# EasyEDA schematic SCH_Mesa_Drivers_2022-08-13.json
TITLE: Sheet_1; REV: 1.0; Date: 2022-06-11; Sheet: 1/1; Drawn By: Edward Niedziejko; Company: Your Company
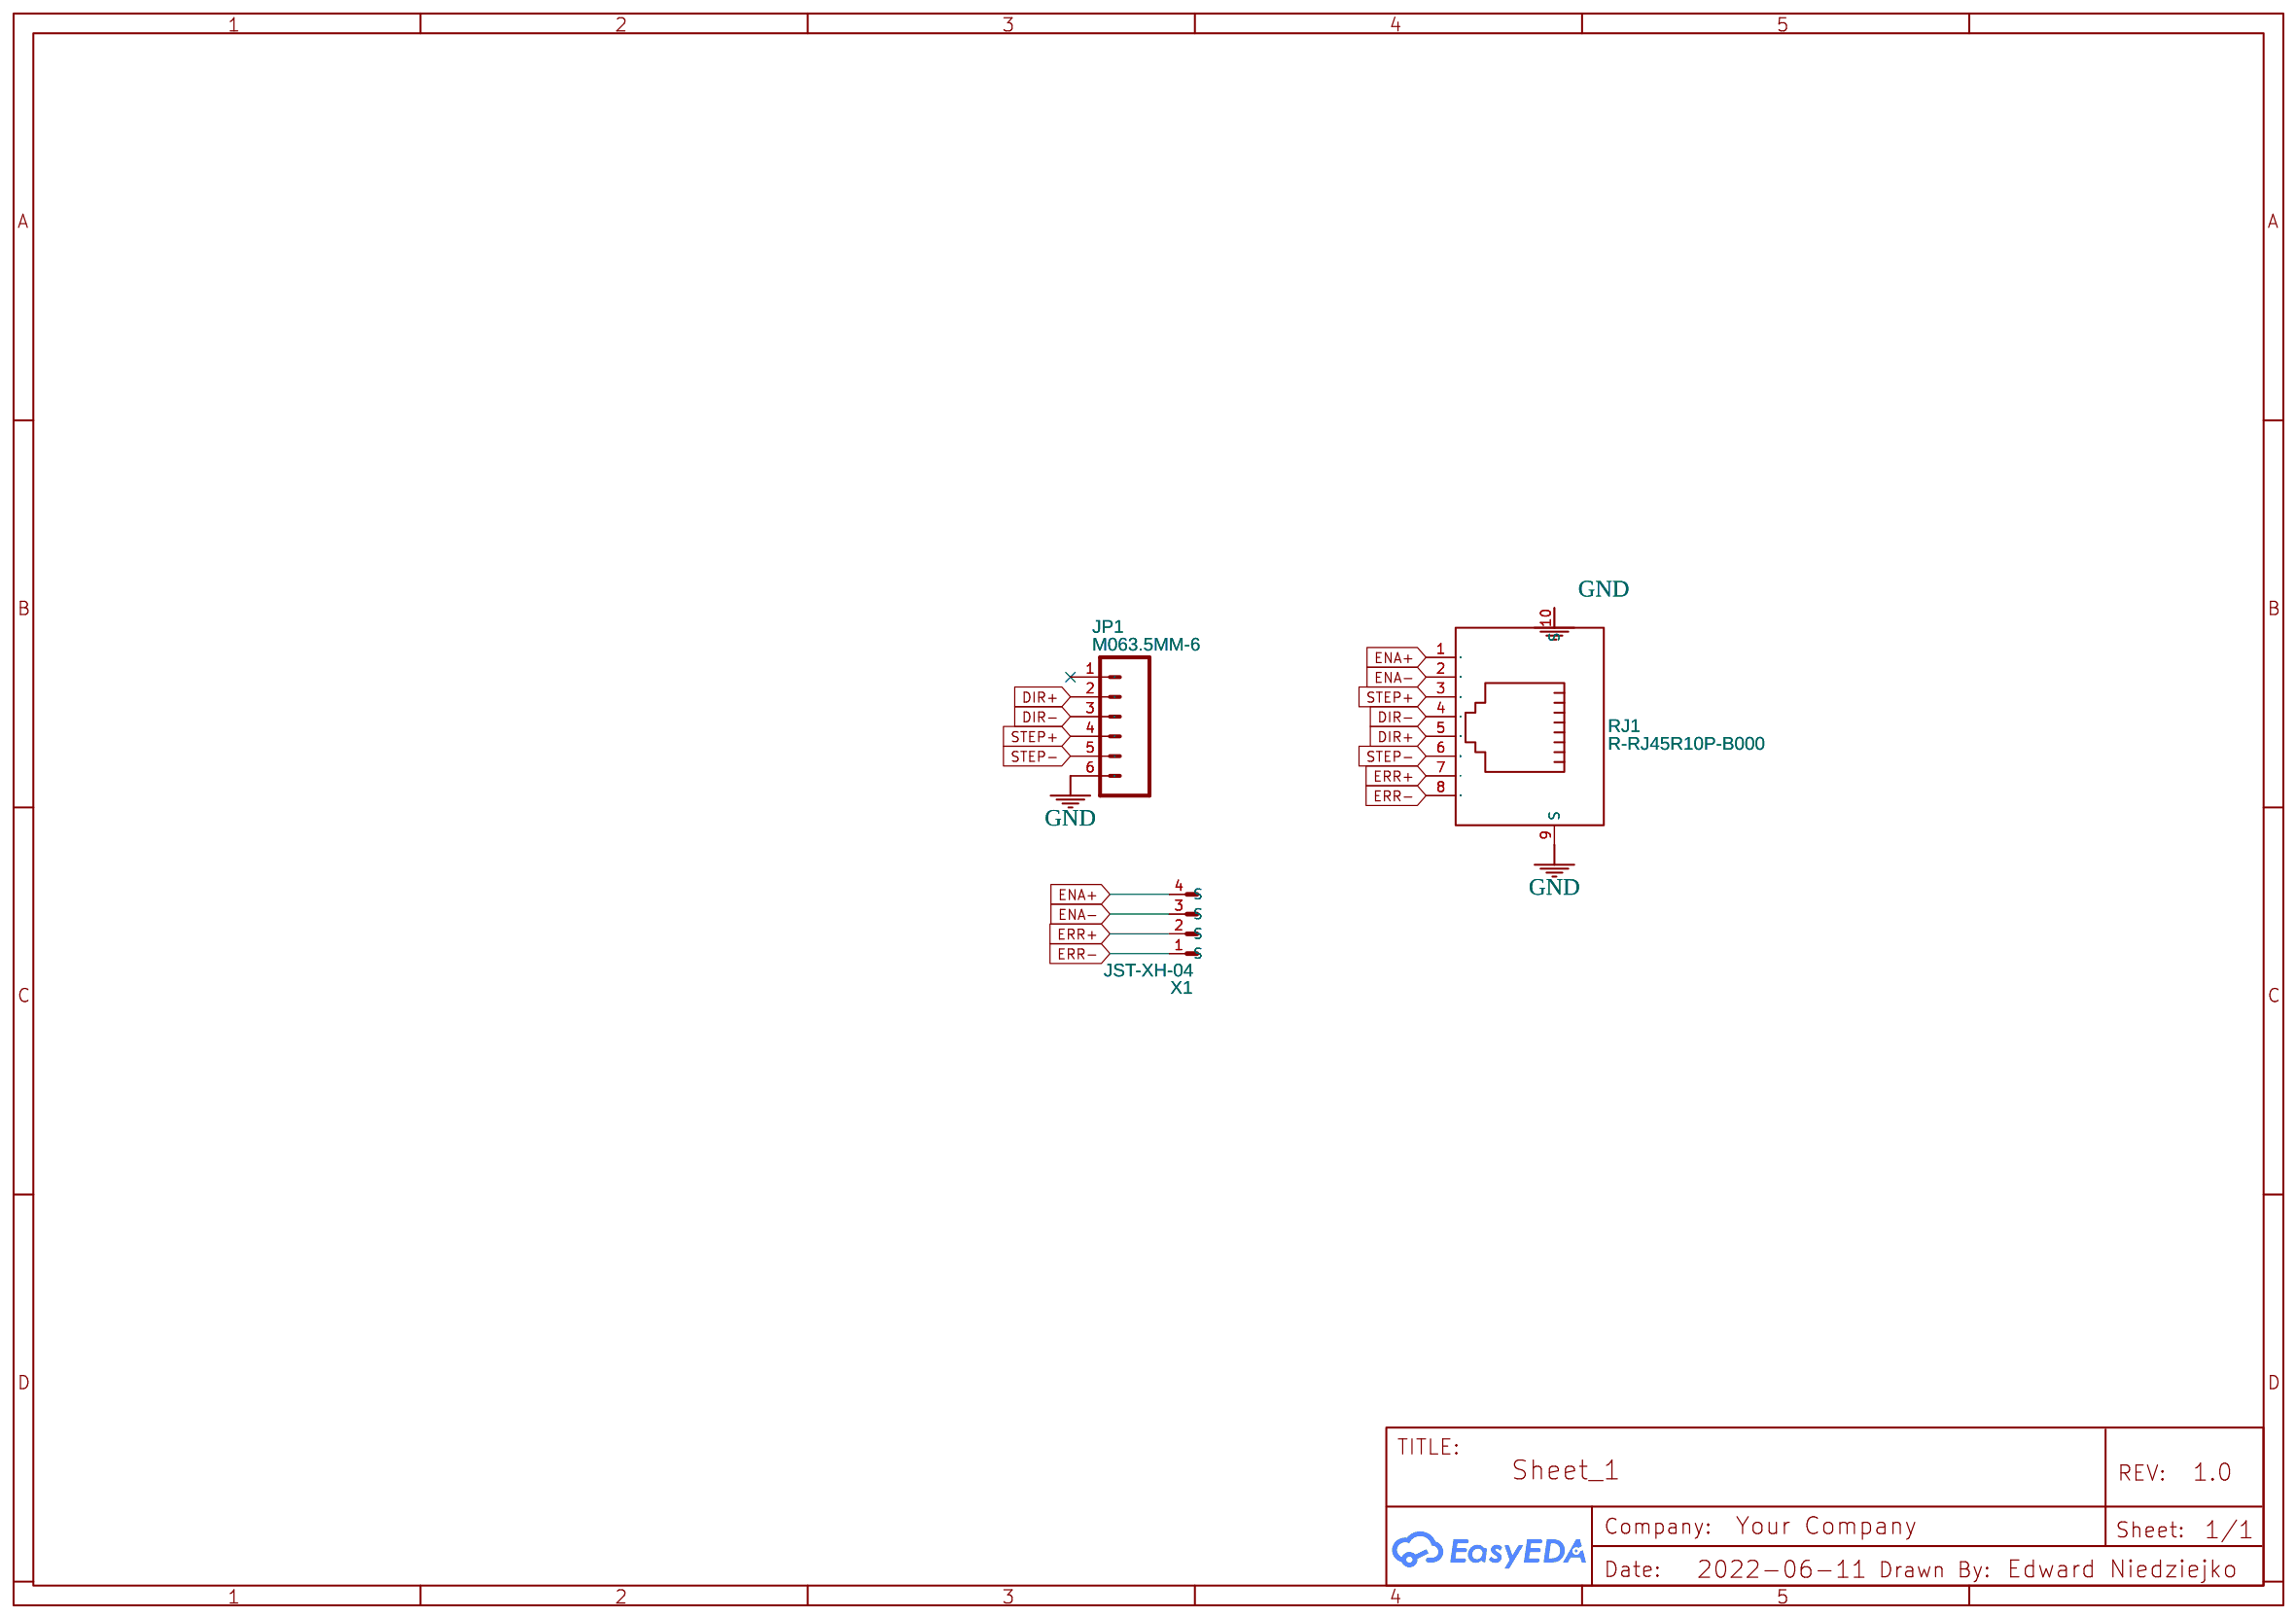
[diagram p0: schematic sheet]

## Parts
JP1  M063.5MM-6  [SCREWTERMINAL-3.5MM-6]
RJ1  R-RJ45R10P-B000  [RJ45-TH_R-RJ45R10P-B000]
X1  JST-XH-04  [JST-XH-04]

## Library data of the parts
JP1 = M063.5MM-6: Header 6; Contributor: SparkFun
RJ1 = R-RJ45R10P-B000: Supplier: LCSC; Supplier Part: C386758; Manufacturer: Shenzhen Cankemeng; Contributor: LCSC; JLCPCB Part Class: Extended Part
X1 = JST-XH-04: Contributor: gi-sfr

## Nets
GND: JP1.6 RJ1.9(S) RJ1.10(S)
DIR+: JP1.2 RJ1.5
DIR-: JP1.3 RJ1.4
ENA+: RJ1.1 X1.4(S)
ENA-: RJ1.2 X1.3(S)
ERR+: RJ1.7 X1.2(S)
ERR-: RJ1.8 X1.1(S)
STEP+: JP1.4 RJ1.3
STEP-: JP1.5 RJ1.6

Not connected (* = marked no-connect by the designer): JP1 1*
